# EAGLE design prufa1 (EAGLE 5.07)
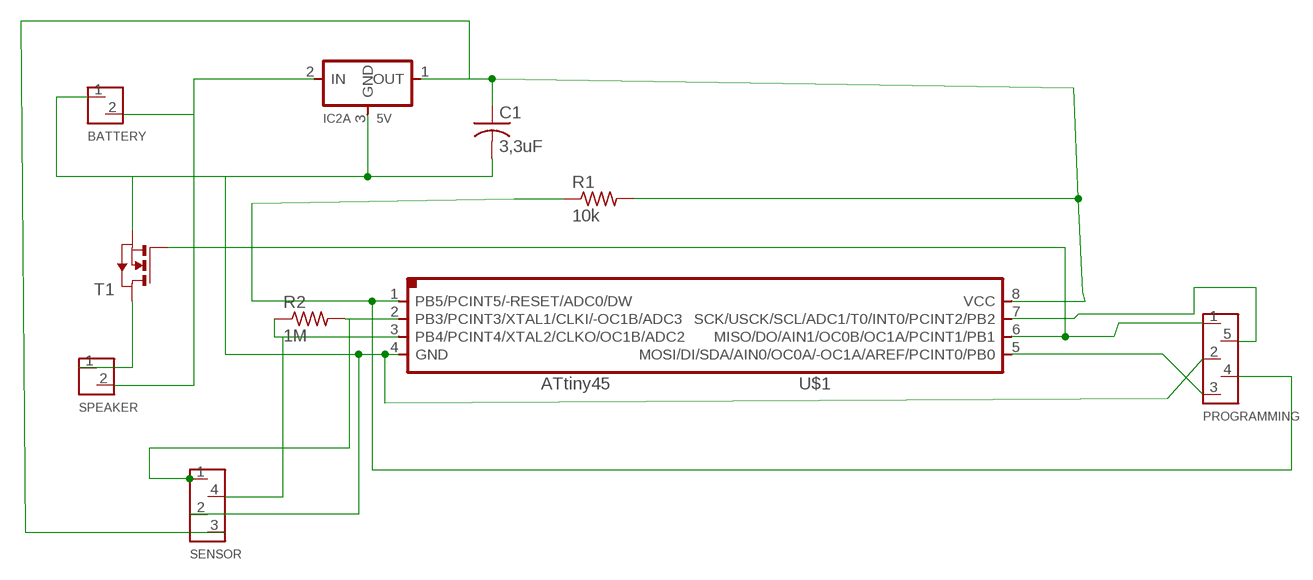
[diagram p0: schematic, sheet 1]

## Parts
BATTERY  MTA_2MTA_2  [MTA_2]
C1  3,3uF  C-USC1206K  [C1206K]
IC2A  5V  REGULATORSOT23  [SOT23]
PROGRAMMING  MTA_5MTA_5  [MTA_5]
R1  10k  RESISTOR1206  [1206]
R2  1M  RESISTOR1206  [1206]
SENSOR  Sensor  MTA_4MTA_4  [MTA_4]
SPEAKER  Speaker  MTA_2MTA_2  [MTA_2]
T1  NMOSFETSOT23  [SOT-23]
U$1  ATTINY45SI  [SOIC8]

## Nets
GND: BATTERY.1 C1.2 IC2A.3(GND) PROGRAMMING.2 SENSOR.2 T1.2(S) U$1.4(GND)
N$1: BATTERY.2 IC2A.2(IN) SPEAKER.2
N$2: PROGRAMMING.4 R1.1 U$1.1(PB5/PCINT5/-RESET/ADC0/DW)
N$3: R2.1 SENSOR.4 U$1.3(PB4/PCINT4/XTAL2/CLKO/OC1B/ADC2)
N$4: R2.2 SENSOR.1 U$1.2(PB3/PCINT3/XTAL1/CLKI/-OC1B/ADC3)
N$5: SPEAKER.1 T1.1(D)
N$8: PROGRAMMING.1 T1.3(G) U$1.6(MISO/DO/AIN1/OC0B/OC1A/PCINT1/PB1)
N$9: PROGRAMMING.3 U$1.5(MOSI/DI/SDA/AIN0/OC0A/-OC1A/AREF/PCINT0/PB0)
N$10: PROGRAMMING.5 U$1.7(SCK/USCK/SCL/ADC1/T0/INT0/PCINT2/PB2)
VCC: C1.1 IC2A.1(OUT) R1.2 SENSOR.3 U$1.8(VCC)

## Library data of the parts
BATTERY SPEAKER = ng:MTA_2
C1 = rcl:C-US: CAPACITOR, American symbol
IC2A = ng:REGULATOR
PROGRAMMING = ng:MTA_5
R1 R2 = ng:RESISTOR
SENSOR = ng:MTA_4
T1 = ng:NMOSFET: MOS FET
U$1 = ng:ATTINY45

## Board
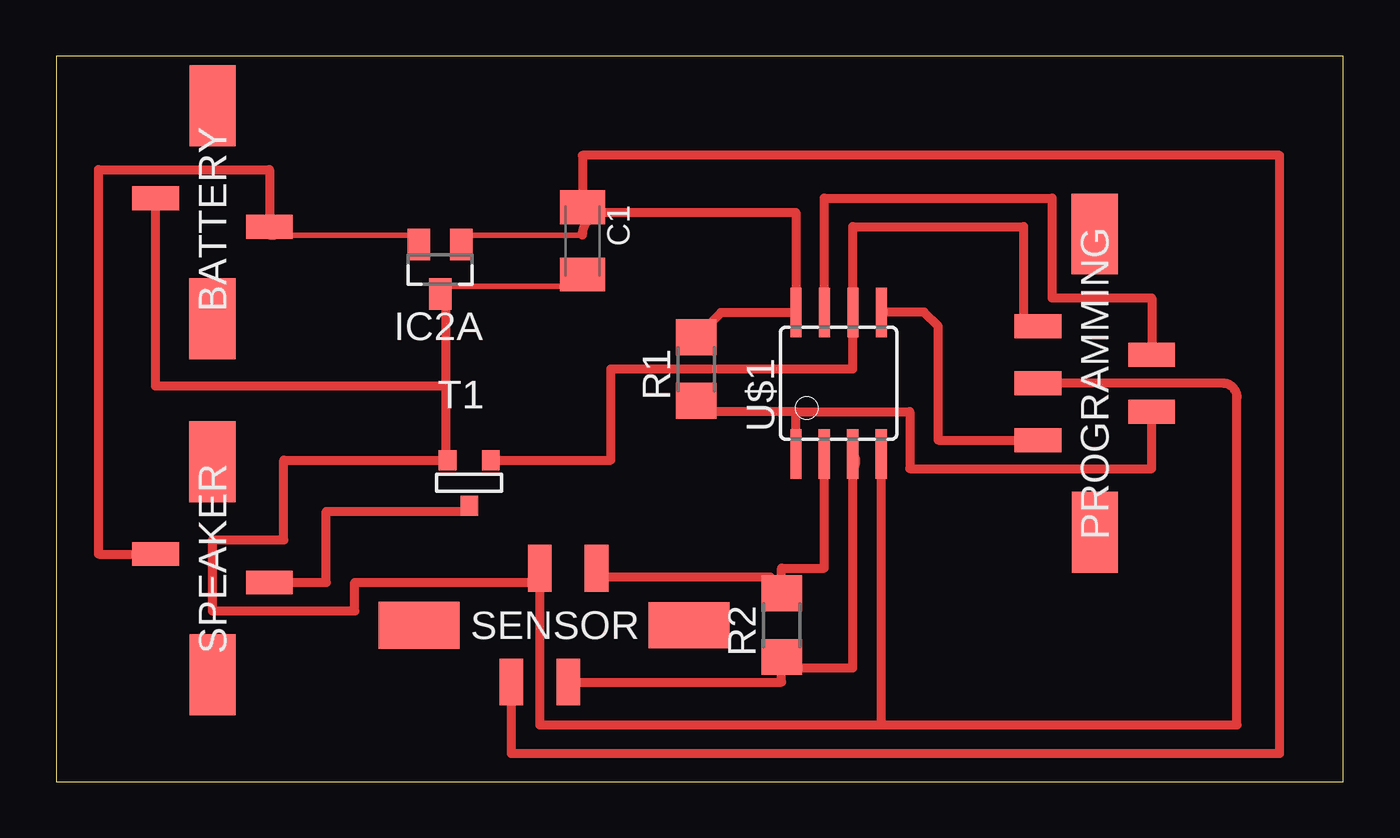
[diagram p1: board, top side]

Size 57.45 x 32.38 mm. Coordinates in mm from the lower left corner, seen from the top.
Outline: 0,0 57.45,0 57.45,32.38 0,32.38 0,0
Copper layers (1*16): Top 0.035mm / dielectric 1.5mm / Bottom 0.035mm
Design rules "default": minimum track width 10mil, minimum drill 24mil, track to track 8mil, track to pad 8mil, pad to pad 8mil, via to via 8mil, smd to smd 8mil, copper to edge 40mil, drill to drill 8mil, minimum pad ring 10mil, minimum via ring 8mil, stop-mask expansion 4mil, vias tented up to drill 0mil, thermal gap 10mil

### Footprints (pad centres in the part's own frame; a part is rotated, then mirrored left to right if it is on the bottom)
MTA_2 = smd 1.067 x 2.083: 1 -0.635,-2.54; 2 0.635,2.54 | smd 3.607 x 2.057: P$5 -4.75,0 | smd 3.607 x 2.083: P$6 4.75,0
C1206K = smd 1.5 x 2: 1 -1.5,0; 2 1.5,0
SOT23 = smd 1 x 1.4: 1 -0.95,-1.1; 2 0.95,-1.1; 3 0,1.1
MTA_5 = smd 1.067 x 2.083: 1 2.54,2.54; 2 0,2.54; 3 -2.54,2.54; 4 -1.27,-2.54; 5 1.27,-2.54 | smd 3.607 x 2.057: P$5 -6.655,0 | smd 3.607 x 2.083: P$6 6.655,0
1206 = smd 1.6 x 1.803: 1 -1.422,0; 2 1.422,0
MTA_4 = smd 1.067 x 2.083: 1 -1.905,-2.54; 2 0.635,-2.54; 3 1.905,2.54; 4 -0.635,2.54 | smd 3.607 x 2.057: P$5 -6.02,0 | smd 3.607 x 2.083: P$6 6.02,0
SOT-23 = smd 0.787 x 0.889: 1 0.025,-1.016; 2 -0.94,1.016; 3 0.991,1.016
SOIC8 = smd 0.5 x 2.2: 1 -1.905,-3.154; 2 -0.645,-3.154; 3 0.625,-3.154; 4 1.895,-3.154; 5 1.905,3.154; 6 0.635,3.154; 7 -0.635,3.154; 8 -1.905,3.154

### Placement (x,y rotation side)
BATTERY  6.99,25.4 270 top
C1  23.49,24.13 270 top
IC2A  17.14,22.86 180 top
PROGRAMMING  46.35,17.78 90 top
R1  28.57,18.41 90 top
R2  32.38,6.99 90 top
SENSOR  22.22,6.99 180 top
SPEAKER  6.99,9.53 90 top
T1  18.41,13.34 0 top
U$1  34.92,17.78 0 top

### Tracks (layer width: path | path; a pad name or v marks a point on that pad's centre or on a via)
GND
  Top 0.254: 17.4,21.34 IC2A.3 17.4,22.1 23.49,22.1 C1.2
  Top 0.406: 17.4,17.65 17.4,21.34 | 17.4,17.65 4.45,17.65 BATTERY.1 | PROGRAMMING.2 52.07,17.78 arc-90 52.7,17.14 52.7,2.54 36.83,2.54 | 36.83,2.54 21.59,2.54 21.59,8.89 | U$1.4 arc-90 36.83,14.62 36.83,2.54 | 17.4,17.65 17.4,14.35 T1.2 10.16,14.35 10.16,10.79 6.99,10.79 6.99,7.62 13.34,7.62 13.34,8.89 21.59,8.89 | 21.59,8.89 SENSOR.2
N$1
  Top 0.254: IC2A.2 15.88,24.38 9.78,24.38 BATTERY.2
  Top 0.406: 9.78,24.38 9.53,24.38 9.53,27.3 1.91,27.3 1.91,10.16 SPEAKER.2
N$2
  Top 0.406: U$1.1 33.02,16.51 | 33.02,16.51 38.1,16.51 38.1,13.97 48.89,13.97 PROGRAMMING.4 | 33.02,16.51 28.57,16.51 R1.1
N$3
  Top 0.254: R2.1 31.88,5.33
  Top 0.406: U$1.3 arc-90 35.56,13.98 35.56,5.08 32.38,5.08 R2.1 32.38,4.45 SENSOR.4
N$4
  Top 0.254: 31.88,9.14 R2.2
  Top 0.406: U$1.2 arc-90 34.29,14.62 34.29,9.53 32.38,9.53 R2.2 | 31.88,9.14 24.13,9.14 SENSOR.1
N$5
  Top 0.406: SPEAKER.1 12.07,8.89 12.07,12.07 18.44,12.07 T1.1
N$8
  Top 0.406: PROGRAMMING.1 43.18,20.32 43.18,24.77 35.56,24.77 U$1.6 35.56,18.41 24.77,18.41 24.77,14.35 T1.3
N$9
  Top 0.406: U$1.5 36.85,20.96 38.73,20.96 39.37,20.32 39.37,15.24 PROGRAMMING.3
N$10
  Top 0.406: U$1.7 34.29,26.04 44.45,26.04 44.45,21.59 48.89,21.59 PROGRAMMING.5
VCC
  Top 0.254: IC2A.1 18.16,24.38 23.49,24.38 C1.1
  Top 0.406: R1.2 29.67,20.93 U$1.8 33.02,25.4 24.51,25.4 arc90 23.49,24.38 | SENSOR.3 20.32,1.27 54.61,1.27 54.61,27.94 23.49,27.94 C1.1